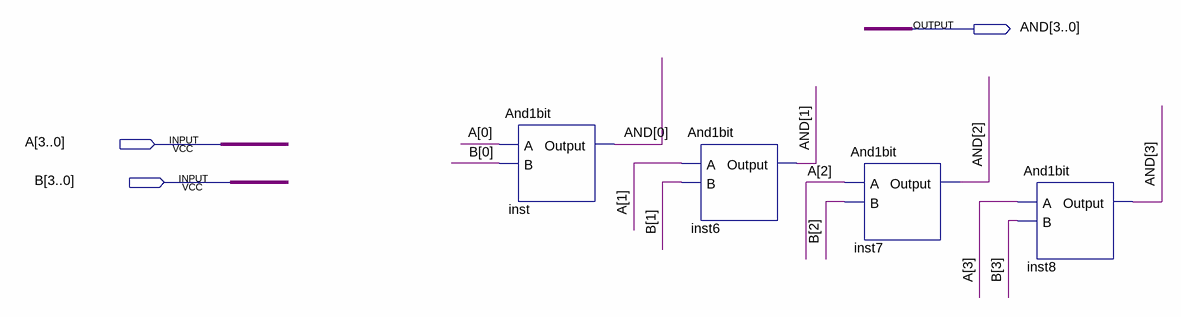
[diagram p0: schematic sheet]
// Quartus schematic AND4BIT.bdf as structural Verilog: 4 symbols, 3 pins
module AND4BIT (
  input  [3:0] A,
  input  [3:0] B,
  output [3:0] AND
);

  And1bit inst (.A(A[0]), .B(B[0]), .Output(AND[0]));
  And1bit inst6 (.A(A[1]), .B(B[1]), .Output(AND[1]));
  And1bit inst7 (.A(A[2]), .B(B[2]), .Output(AND[2]));
  And1bit inst8 (.A(A[3]), .B(B[3]), .Output(AND[3]));
endmodule
